# Altium schematic sheet oscillators.SchDoc: Backplane: Oscillator Section
size Letter; Engineer: Nicholas Morrow; Project: GARY Synthesizer
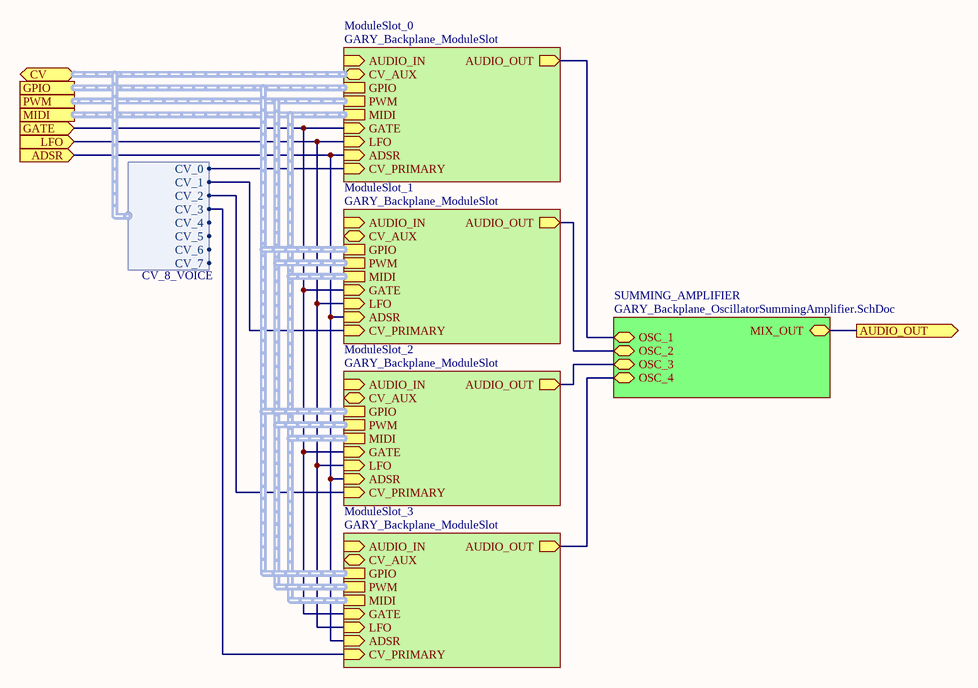
[diagram p0: oscillators.SchDoc]

## Sub-sheets
ModuleSlot_0 = GARY_Backplane_ModuleSlot: GPIO (harness GARY_Module_GPIO), MIDI (harness GARY_Module_MIDI), PWM (harness GARY_Module_PWM), LFO (in), ADSR (in), GATE (in), AUDIO_IN (in), AUDIO_OUT (out), CV_AUX (harness CV_8_VOICE), CV_PRIMARY (in)
ModuleSlot_1 = GARY_Backplane_ModuleSlot: GPIO (harness GARY_Module_GPIO), MIDI (harness GARY_Module_MIDI), PWM (harness GARY_Module_PWM), LFO (in), ADSR (in), GATE (in), AUDIO_IN (in), AUDIO_OUT (out), CV_AUX (harness CV_8_VOICE), CV_PRIMARY (in)
ModuleSlot_2 = GARY_Backplane_ModuleSlot: GPIO (harness GARY_Module_GPIO), MIDI (harness GARY_Module_MIDI), PWM (harness GARY_Module_PWM), LFO (in), ADSR (in), GATE (in), AUDIO_IN (in), AUDIO_OUT (out), CV_AUX (harness CV_8_VOICE), CV_PRIMARY (in)
ModuleSlot_3 = GARY_Backplane_ModuleSlot: GPIO (harness GARY_Module_GPIO), MIDI (harness GARY_Module_MIDI), PWM (harness GARY_Module_PWM), LFO (in), ADSR (in), GATE (in), AUDIO_IN (in), AUDIO_OUT (out), CV_AUX (harness CV_8_VOICE), CV_PRIMARY (in)
SUMMING_AMPLIFIER = GARY_Backplane_OscillatorSummingAmplifier.SchDoc: OSC_1, OSC_2, OSC_3, OSC_4, MIX_OUT

## Ports
ADSR (in), AUDIO_OUT (out), CV (harness CV_8_VOICE), GATE (in), GPIO (harness GARY_Module_GPIO), LFO (in), MIDI (harness GARY_Module_MIDI), PWM (harness GARY_Module_PWM)

## Harnesses
CV_8_VOICE: CV_0, CV_2, CV_4, CV_6, CV_1, CV_3, CV_5, CV_7

## Nets
ADSR: port ADSR, sheet ModuleSlot_0/ADSR, sheet ModuleSlot_1/ADSR, sheet ModuleSlot_2/ADSR, sheet ModuleSlot_3/ADSR
AUDIO_OUT: port AUDIO_OUT, sheet SUMMING_AMPLIFIER/MIX_OUT
GATE: port GATE, sheet ModuleSlot_0/GATE, sheet ModuleSlot_1/GATE, sheet ModuleSlot_2/GATE, sheet ModuleSlot_3/GATE
LFO: port LFO, sheet ModuleSlot_0/LFO, sheet ModuleSlot_1/LFO, sheet ModuleSlot_2/LFO, sheet ModuleSlot_3/LFO
(unnamed): sheet SUMMING_AMPLIFIER/OSC_1, sheet ModuleSlot_0/AUDIO_OUT
(unnamed): sheet SUMMING_AMPLIFIER/OSC_2, sheet ModuleSlot_1/AUDIO_OUT
(unnamed): sheet SUMMING_AMPLIFIER/OSC_3, sheet ModuleSlot_2/AUDIO_OUT
(unnamed): sheet SUMMING_AMPLIFIER/OSC_4, sheet ModuleSlot_3/AUDIO_OUT
(unnamed): sheet ModuleSlot_0/CV_PRIMARY, port CV.CV_0
(unnamed): sheet ModuleSlot_1/CV_PRIMARY, port CV.CV_1
(unnamed): sheet ModuleSlot_2/CV_PRIMARY, port CV.CV_2
(unnamed): sheet ModuleSlot_3/CV_PRIMARY, port CV.CV_3

## Buses and harness runs
harness port CV = sheet ModuleSlot_0/CV_AUX
harness port GPIO = sheet ModuleSlot_0/GPIO = sheet ModuleSlot_1/GPIO = sheet ModuleSlot_2/GPIO = sheet ModuleSlot_3/GPIO
harness port MIDI = sheet ModuleSlot_0/MIDI = sheet ModuleSlot_1/MIDI = sheet ModuleSlot_2/MIDI = sheet ModuleSlot_3/MIDI
harness port PWM = sheet ModuleSlot_0/PWM = sheet ModuleSlot_1/PWM = sheet ModuleSlot_2/PWM = sheet ModuleSlot_3/PWM

## Notes on the sheet
- Notes:
- Title:
- Size:
- Project:
- Letter
- Number:
- Revision:
- Date:
- Engineer:
- Sheet:
- of